# Altium schematic sheet StepDown_LM2596.SchDoc: =DocumentName
size A4; CompanyName: "AS Manufacturing" LLC; Organization: "AS Manufacturing" LLC; Address1: 5 Sklyarenka St.; Address2: Kyiv 04073; Address3: Ukraine; Address4: https://ajax.systems/en/; DocumentNumber: 7; SheetNumber: 7; SheetTotal: 7; Template_version: 1.0.1
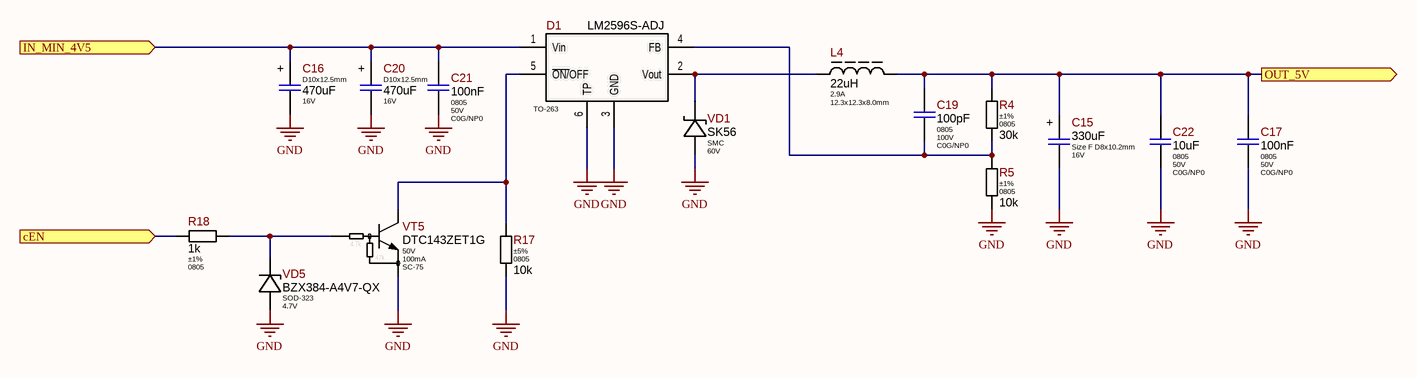
[diagram p0: StepDown_LM2596.SchDoc]

## Parts
C15  value 330uF  Package: Size F D8x10.2mm  Voltage: 16V  [CAP-AE-830x1020H30_MED]  (hidden comment: 330uFx16V)
C16  value 470uF  Package: D10x12.5mm  Voltage: 16V  [CAP-AE-PTH-100D10x125H15]  (hidden comment: 470uFx16V)
C17  Package: 0805  Voltage: 50V  Dielectric Type: C0G/NP0  [C_CERAMIC_0805_HI]  (hidden comment: 100nF)
C19  Package: 0805  Voltage: 100V  Dielectric Type: C0G/NP0  [CAP-0805(2012)X60T10]  (hidden comment: 100pF)
C20  value 470uF  Package: D10x12.5mm  Voltage: 16V  [CAP-AE-PTH-100D10x125H15]  (hidden comment: 470uFx16V)
C21  Package: 0805  Voltage: 50V  Dielectric Type: C0G/NP0  [C_CERAMIC_0805_HI]  (hidden comment: 100nF)
C22  Package: 0805  Voltage: 50V  Dielectric Type: C0G/NP0  [C_CERAMIC_0805_HI]  (hidden comment: 10uF)
D1  Package: TO-263  [TO-263-5-1]  (hidden comment: LM2596S-ADJ)
L4  Current: 2.9A  Package: 12.3x12.3x8.0mm  [CDRH127-Series]  (hidden comment: 22uH)
R4  Tolerance: ±1%  Package: 0805  [R_ANY_CHIP_0805_MED]  (hidden comment: 30k)
R5  Tolerance: ±1%  Package: 0805  [R_ANY_CHIP_0805_MED]  (hidden comment: 10k)
R17  value 10k  Tolerance: ±5%  Package: 0805  [R_ANY_CHIP_0805_MED]  (hidden comment: 68k)
R18  Tolerance: ±1%  Package: 0805  [R_ANY_CHIP_0805_MED]  (hidden comment: 1k)
VD1  Voltage: 60V  [SMC]  (hidden comment: SK56)
VD5  Package: SOD-323  Voltage: 4.7V  [SOD-323_MED]  (hidden comment: BZX384-A4V7-QX)
VT5  Vce: 50V  Ic: 100mA  Package: SC-75  [SOT-416]  (hidden comment: DTC143ZET1G)

## Ports
cEN (in), IN_MIN_4V5 (in), OUT_5V (out)

## Nets
GND: C15.2 C16.2 C17.2 C20.2 C21.2 C22.2 D1.3(GND) D1.6(TP) R5.2 R17.2 VD1.AN VD5.AN VT5.2(E)
cEN: R18.1 ; port cEN
IN_MIN_4V5: C16.1 C20.1 C21.1 D1.1(Vin) ; port IN_MIN_4V5
OUT_5V: C15.1 C17.1 C19.2 C22.1 L4.2 R4.1 ; port OUT_5V
NetC19_1: C19.1 D1.4(FB) R4.2 R5.1
NetD1_2: D1.2(Vout) L4.1 VD1.CA
NetD1_5: D1.5(~{ON/}OFF) R17.1 VT5.3(C)
NetR18_2: R18.2 VD5.CA VT5.1(B)

## Notes on the sheet
- Title
- Product:
- Project:
- Size:
- Date:
- Variant:
- A4
- Authors:
- Time:
- Sheet
- of
- Revision:
- @Vitech_ua
- Commit:
- (in symbol DTC143ZET1G) 4.7k; 47k
- (in symbol EEE-1HA330AP) +
- (in symbol EXR471M16B) +

## Library data of the parts
C15 = EEE-1HA330AP: 330uF 50V ±20% Size F D8x10.2mm SMD Aluminum Electrolytic Capacitor, 110mA Ripple Current, 2000 Hrs @ 85°C; Part Number: EEEFK1C331P; Manufacturer: Panasonic; Standard Lead Time: 46 Weeks; Component Status: Released; Dielectric Type: NONE; Part Type: Aluminum; Component Type: SMD; Temperature Range: -40°C ~ 85°C; Tolerance: ±20%; ComponentLink1URL: https://eu.mouser.com/datasheet/2/315/ABA0000C1142-947446.pdf; Supplier 1: Mouser; Supplier Part Number 1: EEEFK1C331P; Replacement: NONE; Price: 0.625; ComponentLink1Description: Datasheet
C16 = EXR471M16B: 470uF 16V D10x12.5mm Electrolytic Low Impedance; Manufacturer: Hitano; Ajax_1C_ID: 15747; Ajax_1C_PN: 470uF 16V 10x12.5mm EXR EXR471M16B-Hitano pcs; Ajax_1С_Status: Mass Production; Standard Lead Time: NONE; Component Status: Released; Tolerance: ±20%; GUID_1C: 3364ee07-6280-11e9-ab4f-0050569f2651; Part Number: EXR471M16B; Part Type: Aluminum; Component Type: PTH; Temperature Range: -40°C ~ 105°C; Dielectric Type: NONE; ComponentLink1URL: https://www.hitano.com.tw/wp-content/uploads/doc/EXR_20200408.pdf; Replacement: NONE; Price: 0,045; ComponentLink1Description: Datasheet
C17 C21 C22 = CERAMIC_0805: Part Number: **; Manufacturer: Hitano; Component Status: Released; Tolerance: ±5%; Replacement: NONE; GUID_1C: 32087c8a-96b8-11ea-ab61-0050569f2651; Part Type: Ceramic / C0G(NP0) / 0402; Component Type: SMD; Temperature Range: -55°C ~ 125°C; ComponentLink1URL: \\altiumdb.ajax.local\files\Datasheet\Capacitor\Hitano-MLCC.pdf; Price: 0; ComponentLink1Description: Datasheet
  C17 C21: Value: 100nF
  C22: Value: 10uF
C19 = CC0805JRNPO0BN101: 100pF 100V C0G, NP0 ±5% 0805 Ceramic Capacitor RoHS; Manufacturer: Yageo; Ajax_1C_PN: NONE; Ajax_1С_Status: RND Only; Standard Lead Time: 14 Weeks; Component Status: Released; Value: 100pF; Part Number: CC0805JRNPO0BN101; Part Type: Ceramic / C0G(NP0) / 0805; Component Type: SMD; Temperature Range: -55°C ~ 125°C; Tolerance: ±5%; ComponentLink1URL: https://eu.mouser.com/datasheet/2/447/UPY_NP0X7R_MV_100_to_630V_24-2604388.pdf; Supplier 1: Mouser; Supplier Part Number 1: 603-CC805JRNPO0BN101; Replacement: NONE; Price: NONE; ComponentLink1Description: Datasheet
C20 = EXR471M16B: 470uF 16V D10x12.5mm Electrolytic Low Impedance; Part Number: ECAP 470/16V 0812 105'C EHR; Manufacturer: Hitano; Ajax_1C_ID: 15747; Ajax_1C_PN: 470uF 16V 10x12.5mm EXR EXR471M16B-Hitano pcs; Ajax_1С_Status: Mass Production; Standard Lead Time: NONE; Component Status: Released; Tolerance: ±20%; GUID_1C: 3364ee07-6280-11e9-ab4f-0050569f2651; Part Type: Aluminum; Component Type: PTH; Temperature Range: -40°C ~ 105°C; Dielectric Type: NONE; ComponentLink1URL: https://www.hitano.com.tw/wp-content/uploads/doc/EXR_20200408.pdf; Replacement: NONE; Price: 0,045; ComponentLink1Description: Datasheet
D1 = LM2596S-ADJ: SIMPLE SWITCHER Power Converter 150-kHz 3-A Step-Down Voltage Regulator; Manufacturer: Texas Instruments; Ajax_1C_ID: 5535; Ajax_1C_PN: LM2596S-ADJ 150 kHz 3A Step-Down Voltage Regulator; Ajax_1С_Status: Mass Production; Standard Lead Time: 6 Weeks; Component Status: Released; Replacement: NONE; GUID_1C: db77318d-6bf0-11e4-9c1d-a45d36c4a9e5; Part Number: LM2596S-ADJ; Part Type: Power / DC-DC / Buck; Component Type: SMD; Temperature Range: -40°C ~ 125°C; ComponentLink1URL: http://www.ti.com/lit/ds/symlink/lm2596.pdf; Supplier 1: Mouser; Supplier Part Number 1: 926-LM2596S-ADJ/NOPB; Price: 0,44526902; ComponentLink1Description: Datasheet
L4 = CDRH127NP-102MC: 22 µH Shielded Inductor 2.9 A 66mOhm Max Nonstandard; Part Number: CDRH124NP-220MC; Manufacturer: Sumida; Saturation Current: 3.8A; Tolerance: ±20%; Component Status: Released; Standard Lead Time: 17 Weeks; Replacement: NONE; Value: 22uH; Part Type: Power / Ferrite Core; Component Type: SMD; Temperature Range: -40°C ~ 100°C; ComponentLink1URL: https://imrad.com.ua/ru/cdrh124np-220mc; Supplier 1: Mouser; Supplier Part Number 1: 851-CDRH127NP-102MC; Price: 1.55; ComponentLink1Description: Datasheet
R4 = RC0805FR-0730KL: 30 kOhms ±1%, 1/8W 0805 Thick Film Resistor; Manufacturer: Yageo; Ajax_1C_ID: 9642; Ajax_1C_PN: 30k 1% 0805 Resistors SMD RoHS; Ajax_1С_Status: Mass Production; Power Rating: 0.125W; Voltage: 150V; Component Status: Released; Temperature Stability: ±100ppm/°C; Replacement: NONE; GUID_1C: 71e2aa09-07e0-11e7-82d0-d8cb8a9acc66; Value: 30k; Part Number: RC0805FR-0730KL; Component Type: SMD; Part Type: Thick Film; Temperature Range: -55°C ~ 155°C; ComponentLink1URL: https://eu.mouser.com/datasheet/2/447/PYu_RC_Group_51_RoHS_L_10-1664068.pdf; Supplier 1: Digi-Key; Supplier Part Number 1: 311-30.0KCRTR-ND; Price: 0,001; ComponentLink1Description: Datasheet
R5 = RC0805FR-0710K2L: 10 kOhms ±1%, 1/8W 0805 Thick Film Resistor; Manufacturer: Yageo; Ajax_1C_ID: 13943; Ajax_1C_PN: 10.2k 1% 0805 Resistors SMD RoHS; Ajax_1С_Status: Mass Production; Power Rating: 0.125W; Voltage: 150V; Component Status: Released; Temperature Stability: ±100ppm/°C; Replacement: NONE; GUID_1C: 8bc9d0ce-c58a-11e8-ab47-0050569f2651; Value: 10k; Part Number: RC0805FR-0710K2L; Component Type: SMD; Part Type: Thick Film; Temperature Range: -55°C ~ 155°C; ComponentLink1URL: https://eu.mouser.com/datasheet/2/447/PYu_RC_Group_51_RoHS_L_10-1664068.pdf; Supplier 1: Digi-Key; Supplier Part Number 1: 311-10.2KCRTR-ND; Price: 0,0014; ComponentLink1Description: Datasheet
R17 = RC0805JR-072K2L: 2.2 kOhms ±5% 1/8W 0805 Thick Film Resistor; Manufacturer: Yageo; Ajax_1C_ID: 26119; Ajax_1C_PN: 2.2k 5% 0805 Resistors SMD RoHS; Ajax_1С_Status: RND Only; Power Rating: 0.125W; Voltage: 150V; Component Status: Released; Temperature Stability: ±100ppm/°C; Replacement: NONE; GUID_1C: 80325ec8-617a-11eb-ab6f-0050569f2651; Part Number: RC0805JR-072K2L; Component Type: SMD; Part Type: Thick Film; Temperature Range: -55°C ~ 155°C; ComponentLink1URL: https://eu.mouser.com/datasheet/2/447/PYu_RC_Group_51_RoHS_L_11-1984063.pdf; Supplier 1: Digi-Key; Supplier Part Number 1: 311-2.2KARTR-ND; Price: 0,005; ComponentLink1Description: Datasheet
R18 = RC0805FR-072K2L: 2.2 kOhms ±1% 1/8W 0805 Thick Film Resistor; Manufacturer: Yageo; Ajax_1C_ID: 30906; Ajax_1C_PN: 2.2k 1% 0805 Resistors SMD RoHS; Ajax_1С_Status: RND Only; Power Rating: 0.125W; Voltage: 150V; Component Status: Released; Temperature Stability: ±100ppm/°C; Replacement: NONE; GUID_1C: 690422a9-c9eb-11eb-ab74-0050569f2651; Value: 1k; Part Number: RC0805FR-072K2L; Component Type: SMD; Part Type: Thick Film; Temperature Range: -55°C ~ 155°C; ComponentLink1URL: https://eu.mouser.com/datasheet/2/447/YAGEO_PYu_RC_Group_51_RoHS_L_12-3313492.pdf; Supplier 1: Mouser; Supplier Part Number 1: 603-RC0805FR-072K2L; Price: 0.0014; ComponentLink1Description: Datasheet
VD1 = SS34: Diode Schottky 60V 5A, SMC; Manufacturer: KLS; Component Status: Released; Standard Lead Time: 14 Weeks; Current: 3A; Vf: 500mV @ 3A; Replacement: NONE; Part Number: SK56; Package: SMC; Part Type: Schottky; Component Type: SMD; Marking: SK56; Temperature Range: -55°C ~ 150°C; Supplier 1: Digi-Key; Supplier Part Number 1: SS34FSCT-ND; Price: 0.03; ComponentLink1Description: Datasheet
VD5 = BZX384-A4V7-QX: Zener Diode 4.7V, 300mW, ±1%, Leakage 3uA @ 2V, SOD-323; Manufacturer: Nexperia USA; Ajax_1C_PN: NONE; Ajax_1С_Status: RND Only; Marking: 22; Component Status: Released; Standard Lead Time: 4 Weeks; Part Number: BZX384-A4V7-QX; Part Type: Zener; Component Type: SMD; Temperature Range: -65°C ~ 150°C; ComponentLink1URL: https://eu.mouser.com/datasheet/2/916/BZX384_Q_SER-2721638.pdf; Supplier 1: Mouser; Supplier Part Number 1: 771-BZX384-A4V7-QX; Replacement: NONE; Price: NONE; ComponentLink1Description: Datasheet
VT5 = DTC143ZET1G: 50V, 100mA Low Vce(sat) NPN Digital Transistor, Pre-Biased 4.7k/47k (with built-in resistors); Manufacturer: Onsemi; Ajax_1C_ID: 9410; Ajax_1C_PN: DTC143ZET1G SC-75-3  биполярный NPN транзистор; Ajax_1С_Status: Mass Production; Component Status: Released; Standard Lead Time: 8 Weeks; Replacement: NONE; GUID_1C: d76ac5d5-de69-11e6-829b-d8cb8a9acc66; Part Number: DTC143ZET1G; Part Type: NPN; Component Type: SMD; Temperature Range: -55°C ~ 150 °C; ComponentLink1URL: http://www.onsemi.com/pub/Collateral/DTC143Z-D.PDF; Supplier 1: Digi-Key; Supplier Part Number 1: DTC143ZET1GOSTR-ND; Price: 0.015; ComponentLink1Description: Datasheet